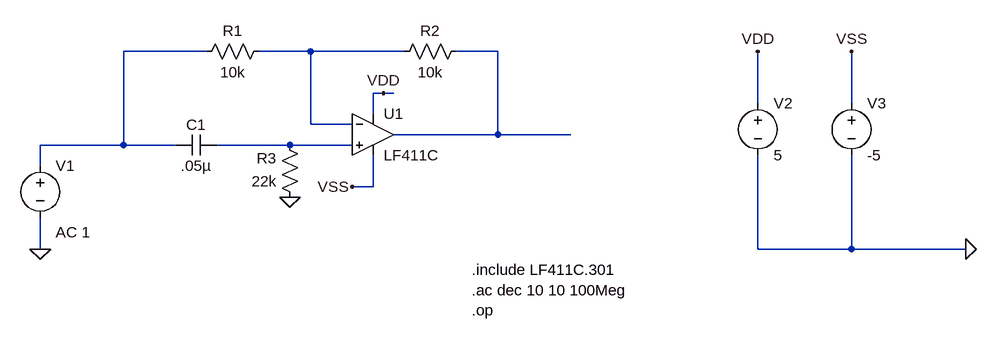
[diagram p0: schematic Draft16.asc]
Draft16.asc, the LTspice schematic file:
Version 4
SHEET 1 1152 680
WIRE -32 208 -160 208
WIRE 128 208 48 208
WIRE 272 208 128 208
WIRE 416 208 352 208
WIRE 240 272 224 272
WIRE 256 272 240 272
WIRE 816 288 816 208
WIRE 960 288 960 208
WIRE 224 304 224 272
WIRE 128 320 128 208
WIRE 192 320 128 320
WIRE 416 336 416 208
WIRE 416 336 256 336
WIRE 528 336 416 336
WIRE -160 352 -160 208
WIRE -160 352 -288 352
WIRE -80 352 -160 352
WIRE 96 352 -16 352
WIRE 192 352 96 352
WIRE -288 384 -288 352
WIRE 224 416 224 368
WIRE 224 416 192 416
WIRE -288 512 -288 464
WIRE 816 512 816 368
WIRE 960 512 960 368
WIRE 960 512 816 512
WIRE 1136 512 960 512
FLAG 192 416 VSS
FLAG 240 272 VDD
FLAG 816 208 VDD
FLAG 960 208 VSS
FLAG 1136 512 0
FLAG 96 432 0
FLAG -288 512 0
SYMBOL res 64 192 R90
WINDOW 0 0 56 VBottom 2
WINDOW 3 32 56 VTop 2
SYMATTR InstName R1
SYMATTR Value 10k
SYMBOL res 368 192 R90
WINDOW 0 0 56 VBottom 2
WINDOW 3 32 56 VTop 2
SYMATTR InstName R2
SYMATTR Value 10k
SYMBOL res 112 448 R180
WINDOW 0 36 76 Left 2
WINDOW 3 36 40 Left 2
SYMATTR InstName R3
SYMATTR Value 22k
SYMBOL cap -16 336 R90
WINDOW 0 0 32 VBottom 2
WINDOW 3 32 32 VTop 2
SYMATTR InstName C1
SYMATTR Value .05µ
SYMBOL OpAmps/opamp2 224 272 R0
SYMATTR InstName U1
SYMATTR Value LF411C
SYMBOL voltage -288 368 R0
WINDOW 123 24 118 Left 2
SYMATTR InstName V1
SYMATTR Value ""
SYMATTR Value2 AC 1
SYMBOL voltage 816 272 R0
SYMATTR InstName V2
SYMATTR Value 5
SYMBOL voltage 960 272 R0
SYMATTR InstName V3
SYMATTR Value -5
TEXT 376 544 Left 2 !.include LF411C.301\n.ac dec 10 10 100Meg\n.op

The netlist it stands for:
* Draft16.asc
R1 N002 N001 10k
R2 N003 N002 10k
R3 0 N004 22k
C1 N004 N001 .05µ
XU1 N004 N002 VDD VSS N003 LF411C  ; pins In+ In- V+ V- OUT
V1 N001 0 AC 1
V2 VDD 0 5
V3 VSS 0 -5
.include LF411C.301
.ac dec 10 10 100Meg
.op
.backanno
.end